# EasyEDA schematic Schametic.json
TITLE: Sheet_1; REV: 1.0; Date: 2026-03-11; Sheet: 1/1; Drawn By: rudravenommishraa; Company: Your Company
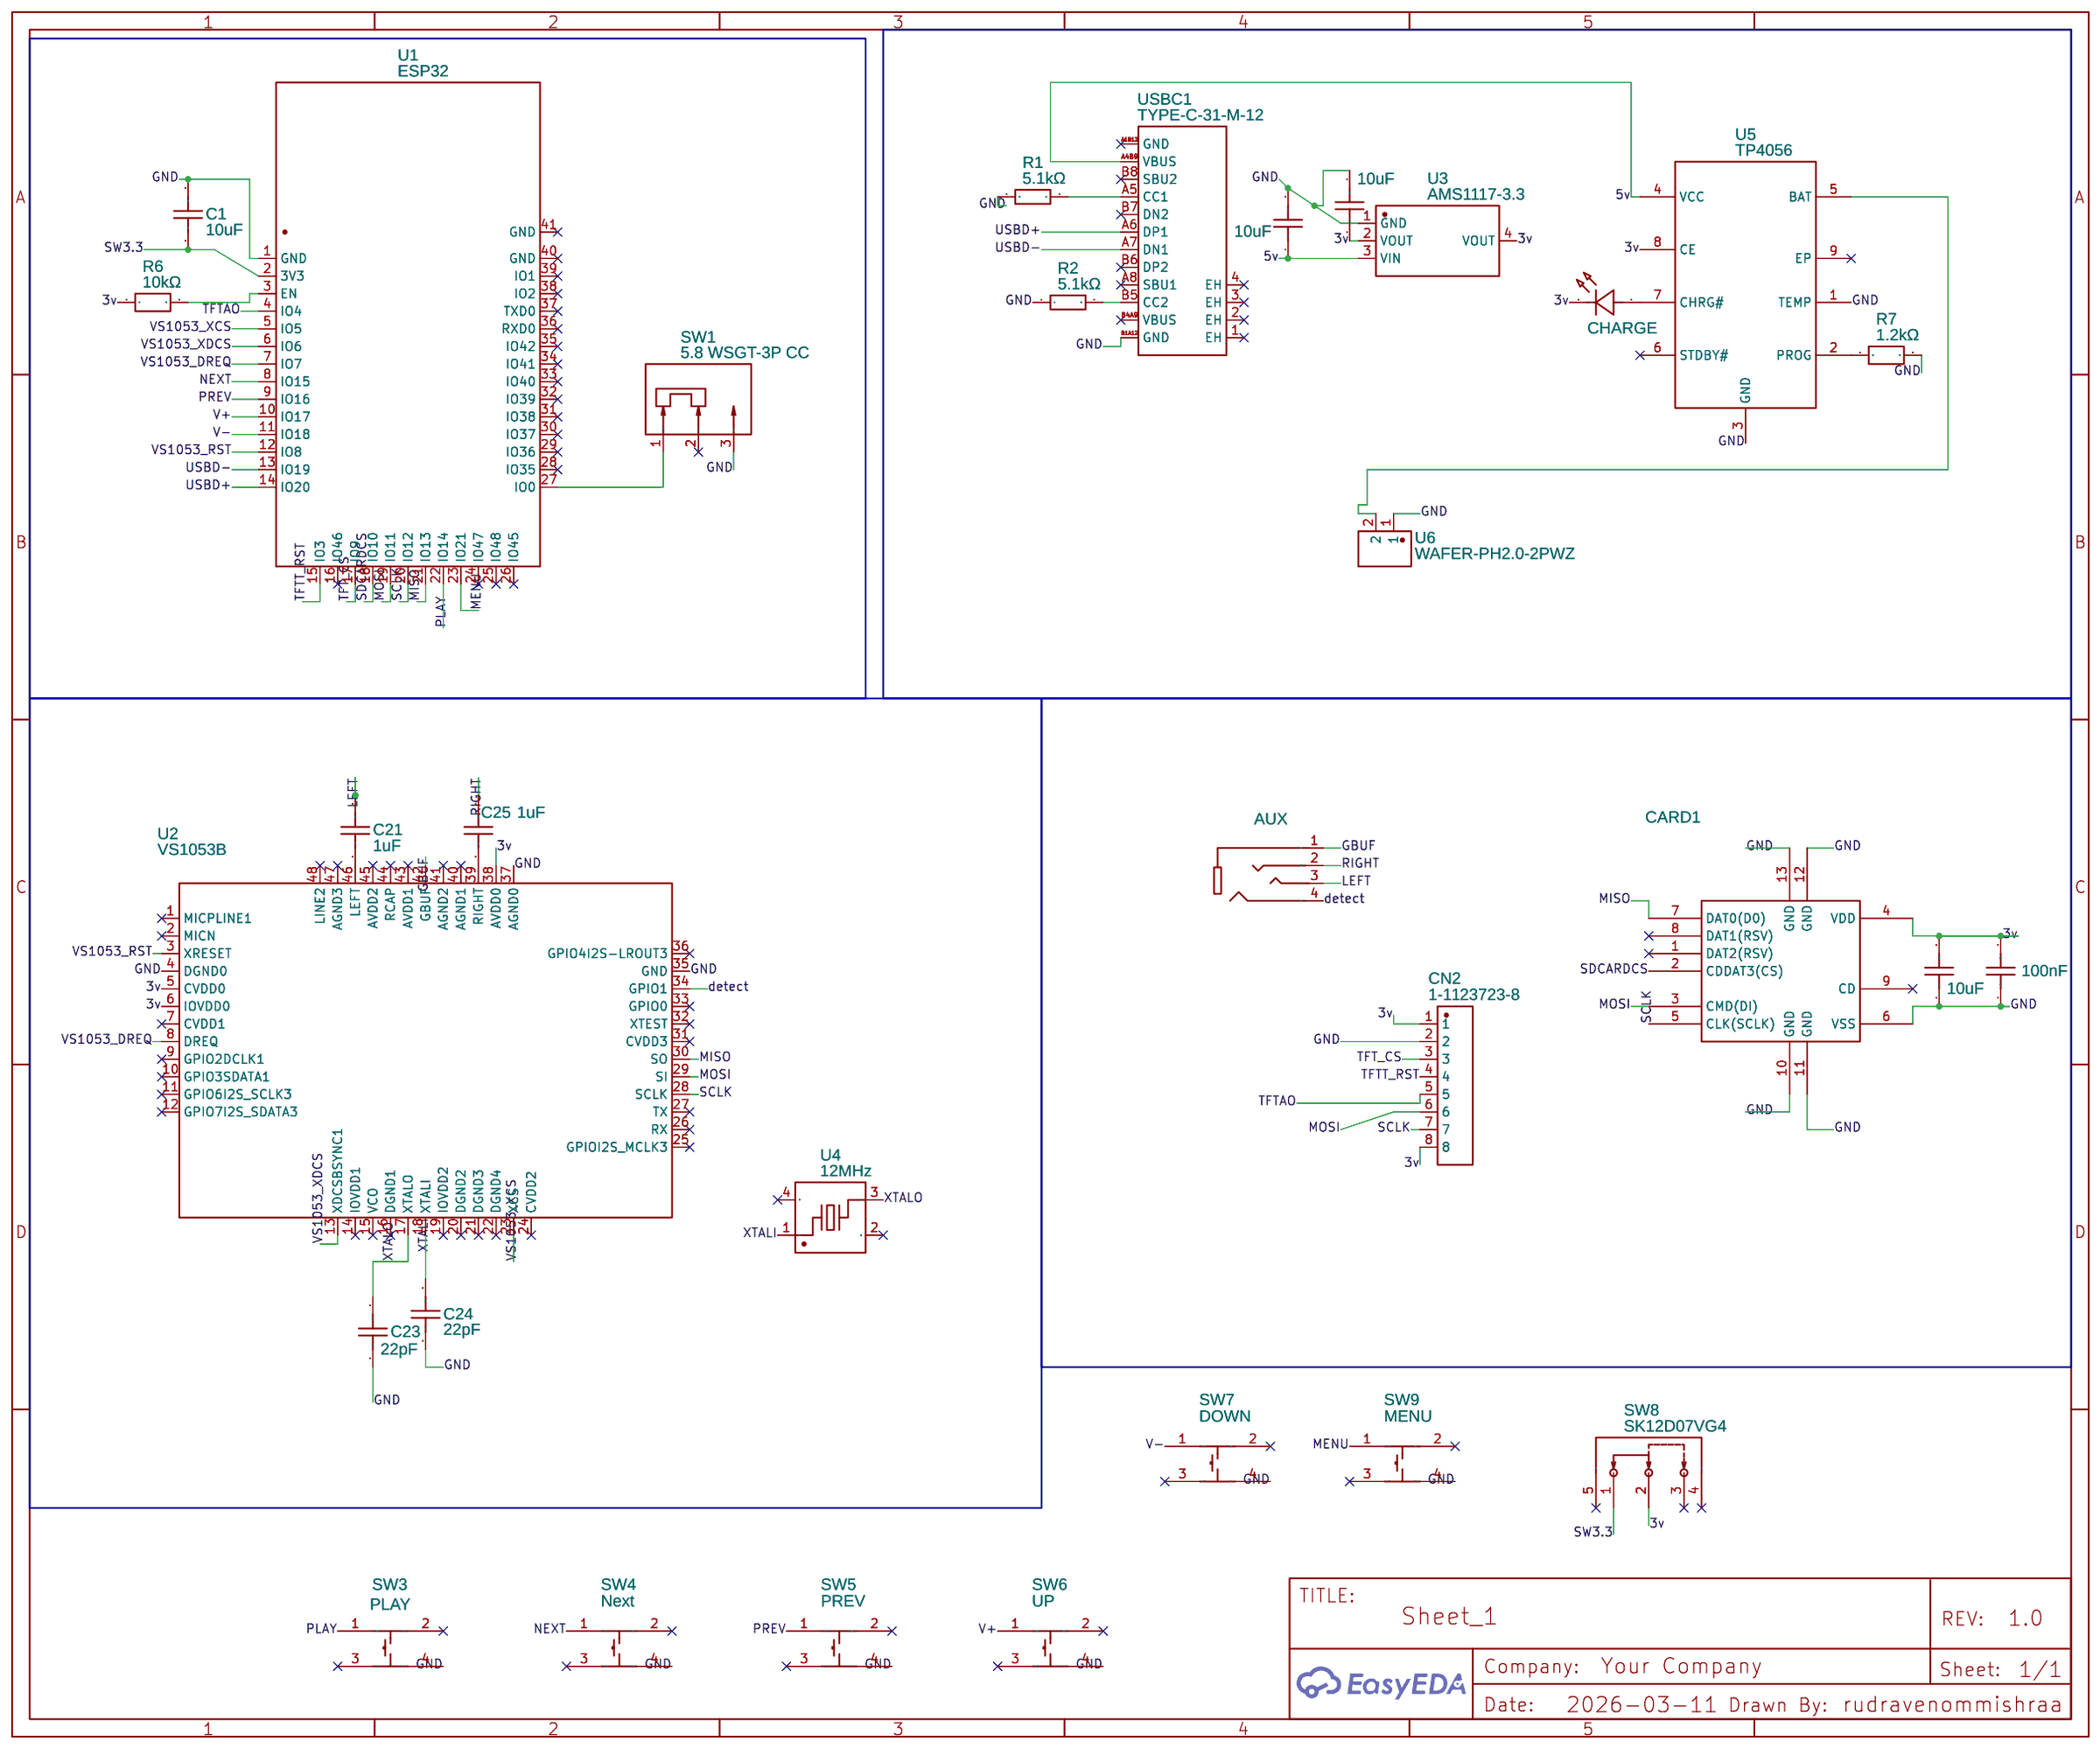
[diagram p0: schematic sheet]

## Parts
C1  10uF  [C0603]
C2  10uF  [C0603]
C7  100nF  [C0603]
C9  10uF  [C0603]
C10  10uF  [C0603]
C21  1uF  [C0603]
C23  22pF  [C0402]
C24  22pF  [C0402]
C25  1uF  [C0603]
CARD1  TF-01A  [TF-SMD_TF-01A]
CHARGE  15-21SURC/S530-A3/3T  [LED1206-R-RD_RED]
CN1  AUX  [AUDIO-SMD_HC-PJ-320A]
CN2  1-1123723-8  [CONN-TH_1-1123723-8]
R1  5.1kΩ  [R0603]
R2  5.1kΩ  [R0603]
R6  10kΩ  [R0603]
R7  1.2kΩ  [R0603]
SW1  5.8 WSGT-3P CC  [SW-TH_3P-L5.8_WSGT-3P-CC]
SW3  PLAY  [KEY-SMD_4P-L6.0-W6.0-P4.50-LS9.0]
SW4  Next  [KEY-SMD_4P-L6.0-W6.0-P4.50-LS9.0]
SW5  PREV  [KEY-SMD_4P-L6.0-W6.0-P4.50-LS9.0]
SW6  UP  [KEY-SMD_4P-L6.0-W6.0-P4.50-LS9.0]
SW7  DOWN  [KEY-SMD_4P-L6.0-W6.0-P4.50-LS9.0]
SW8  SK12D07VG4  [SW-TH_SK12D07VG4]
SW9  MENU  [KEY-SMD_4P-L6.0-W6.0-P4.50-LS9.0]
U1  ESP32  [WIRELM-SMD_ESP32-S3-WROOM-1]
U2  VS1053B  [LQFP-48_L7.0-W7.0-P0.50-LS9.0-BL]
U3  AMS1117-3.3  [SOT-223-3_L6.5-W3.4-P2.30-LS7.0-BR]
U4  12MHz  [CRYSTAL-SMD_4P-L3.2-W2.5-BL]
U5  TP4056  [ESOP-8_L4.9-W3.9-P1.27-LS6.0-BL-EP]
U6  WAFER-PH2.0-2PWZ  [CONN-TH_2P-P2.00_GP01-2001WR-2P]
USBC1  TYPE-C-31-M-12  [USB-C_SMD-TYPE-C-31-M-12_1]

## Library data of the parts
C1 C2 C9 C10 = CL10A106KP8NNNC: Supplier: LCSC; Manufacturer: SAMSUNG(三星); Supplier Part: C19702; JLCPCB Part Class: Basic Part
C7 = CC0603KRX7R9BB104: Supplier: LCSC; Manufacturer: YAGEO(国巨); Supplier Part: C14663; JLCPCB Part Class: Basic Part
C21 C25 = CL10A105KB8NNNC: Supplier: LCSC; Manufacturer: SAMSUNG(三星); Supplier Part: C15849; JLCPCB Part Class: Basic Part
C23 C24 = 04025A220KAT2A: Contributor: LCSC; Supplier: LCSC; Supplier Part: C597024; Manufacturer: Kyocera AVX; JLCPCB Part Class: Extended Part
CARD1 = TF-01A: Supplier: LCSC; Manufacturer: 韩国韩荣; Supplier Part: C91145; JLCPCB Part Class: Extended Part
CHARGE = 15-21SURC/S530-A3/3T: Supplier: LCSC; Supplier Part: C2984265; Manufacturer: EVERLIGHT(亿光); JLCPCB Part Class: Extended Part; Contributor: lcsc
CN1 = HC-PJ-320A: Supplier: LCSC; Supplier Part: C7501806; Manufacturer: HC(虹成电子); Contributor: lcsc; JLCPCB Part Class: Extended Part
CN2 = 1-1123723-8: Contributor: LCSC; Supplier: LCSC; Supplier Part: C498700; Manufacturer: TE Connectivity(泰科电子); JLCPCB Part Class: Extended Part
R1 R2 = 0603WAF5101T5E: Supplier: LCSC; Manufacturer: UNI-ROYAL(厚声); Supplier Part: C23186; JLCPCB Part Class: Basic Part
R6 = SCR0603J10K: Supplier: LCSC; Supplier Part: C3017715; Manufacturer: VO(翔胜); Contributor: lcsc; JLCPCB Part Class: Extended Part
R7 = 0603WAD1201T5E: Contributor: LCSC; Supplier: LCSC; Supplier Part: C423085; Manufacturer: UNI-ROYAL(厚声); JLCPCB Part Class: Extended Part
SW1 = 5.8 WSGT-3P CC: Supplier: LCSC; Supplier Part: C22386787; Manufacturer: SHOU HAN(首韩); Contributor: lcsc; JLCPCB Part Class: Extended Part
SW3-SW7 SW9 = TS-1002S-07026C: Contributor: LCSC; Supplier: LCSC; Supplier Part: C455114; Manufacturer: XUNPU(讯普); JLCPCB Part Class: Extended Part
SW8 = SK12D07VG4: Contributor: LCSC; Supplier: LCSC; Supplier Part: C393937; Manufacturer: SHOU HAN(首韩); JLCPCB Part Class: Extended Part
U1 = ESP32-S3-WROOM-1(N16R8): Contributor: lcsc; Supplier: LCSC; Supplier Part: C2913202; Manufacturer: ESPRESSIF(乐鑫); Manufacturer Part: ESP32-S3-WROOM-1-N16R8; JLCPCB Part Class: Extended Part
U2 = VS1053B: sourceId: 1T5FDZYC8; Supplier: LCSC; Manufacturer: VLSI; Manufacturer Part: VS1053B-L; Supplier Part: C9922; JLCPCB Part Class: Extended Part
U3 = AMS1117-3.3: sourceId: dwIGgezVh; Supplier: LCSC; Manufacturer: AMS; Supplier Part: C6186; JLCPCB Part Class: Basic Part
U4 = 01.X.MH.120HHRI0012000000: Supplier: LCSC; Supplier Part: C7462556; Manufacturer: CREC(晶宝); JLCPCB Part Class: Extended Part; Contributor: lcsc
U5 = TP4056: Contributor: Guest; Supplier: LCSC; Manufacturer: TOPPOWER(南京拓微); Manufacturer Part: TP4056-42-ESOP8; Supplier Part: C16581; JLCPCB Part Class: Extended Part
U6 = WAFER-PH2.0-2PWZ: Supplier: LCSC; Supplier Part: C5359610; Manufacturer: XUNPU(讯普); JLCPCB Part Class: Extended Part; Contributor: lcsc
USBC1 = TYPE-C-31-M-12: Contributor: LCSC; Supplier: LCSC; Supplier Part: C165948; Manufacturer: 韩国韩荣; JLCPCB Part Class: Extended Part

## Nets
3v: C2.2 C7.2 C10.1 CARD1.4(VDD) CHARGE.2(K) CN2.1 CN2.8 R6.1 SW8.2 U2.5(CVDD0) U2.6(IOVDD0) U2.38(AVDD0) U3.2(VOUT) U3.4(VOUT) U5.8(CE)
5v: C9.1 U3.3(VIN) U5.4(VCC) USBC1.A4B9(VBUS)
GND: C1.2 C2.1 C7.1 C9.2 C10.2 C23.1 C24.1 CARD1.6(VSS) CARD1.10(GND) CARD1.11(GND) CARD1.12(GND) CARD1.13(GND) CN2.2 R1.1 R2.1 R7.2 SW1.3 SW3.4 SW4.4 SW5.4 SW6.4 SW7.4 SW9.4 U1.1(GND) U2.4(DGND0) U2.35(GND) U2.37(AGND0) U3.1(GND) U5.1(TEMP) U5.3(GND) U6.1 USBC1.B1A12(GND)
detect: CN1.4 U2.34(GPIO1)
GBUF: CN1.1 U2.42(GBUF)
LEFT: C21.2 CN1.3
MENU: SW9.1 U1.23(IO21)
MISO: CARD1.7(DAT0(D0)) U1.21(IO13) U2.30(SO)
MOSI: CARD1.3(CMD(DI)) CN2.6 U1.19(IO11) U2.29(SI)
NEXT: SW4.1 U1.8(IO15)
PLAY: SW3.1 U1.22(IO14)
PREV: SW5.1 U1.9(IO16)
RIGHT: C25.1 CN1.2
SCLK: CARD1.5(CLK(SCLK)) CN2.7 U1.20(IO12) U2.28(SCLK)
SDCARDCS: CARD1.2(CDDAT3(CS)) U1.18(IO10)
SW3.3: C1.1 SW8.1 U1.2(3V3)
TFT_CS: CN2.3 U1.17(IO9)
TFTAO: CN2.5 U1.4(IO4)
TFTT_RST: CN2.4 U1.15(IO3)
USBD+: U1.14(IO20) USBC1.A6(DP1)
USBD-: U1.13(IO19) USBC1.A7(DN1)
V+: SW6.1 U1.10(IO17)
V-: SW7.1 U1.11(IO18)
VS1053_DREQ: U1.7(IO7) U2.8(DREQ)
VS1053_RST: U1.12(IO8) U2.3(XRESET)
VS1053_XCS: U1.5(IO5) U2.23(XCS)
VS1053_XDCS: U1.6(IO6) U2.13(XDCSBSYNC1)
XTALI: C24.2 U2.18(XTALI) U4.1
XTALO: C23.2 U2.17(XTALO) U4.3
Net-(C21-1): C21.1 U2.46(LEFT)
Net-(C25-2): C25.2 U2.39(RIGHT)
Net-(CHARGE-1): CHARGE.1(A) U5.7(CHRG#)
Net-(R1-2): R1.2 USBC1.A5(CC1)
Net-(R2-2): R2.2 USBC1.B5(CC2)
Net-(R6-2): R6.2 U1.3(EN)
Net-(R7-1): R7.1 U5.2(PROG)
Net-(SW1-1): SW1.1 U1.27(IO0)
Net-(U5-5): U5.5(BAT) U6.2

Not connected (* = marked no-connect by the designer): CARD1 1(DAT2(RSV))* 8(DAT1(RSV))* 9(CD)*; SW1 2*; SW3 2* 3*; SW4 2* 3*; SW5 2* 3*; SW6 2* 3*; SW7 2* 3*; SW8 3* 4* 5*; SW9 2* 3*; U1 16(IO46)* 24(IO47)* 25(IO48)* 26(IO45)* 28(IO35)* 29(IO36)* 30(IO37)* 31(IO38)* 32(IO39)* 33(IO40)* 34(IO41)* 35(IO42)* 36(RXD0)* 37(TXD0)* 38(IO2)* 39(IO1)* 40(GND)* 41(GND)*; U2 1(MICPLINE1)* 2(MICN)* 7(CVDD1)* 9(GPIO2DCLK1)* 10(GPIO3SDATA1)* 11(GPIO6I2S_SCLK3)* 12(GPIO7I2S_SDATA3)* 14(IOVDD1)* 15(VCO)* 16(DGND1)* 19(IOVDD2)* 20(DGND2)* 21(DGND3)* 22(DGND4)* 24(CVDD2)* 25(GPIOI2S_MCLK3)* 26(RX)* 27(TX)* 31(CVDD3)* 32(XTEST)* 33(GPIO0)* 36(GPIO4I2S-LROUT3)* 40(AGND1)* 41(AGND2)* 43(AVDD1)* 44(RCAP)* 45(AVDD2)* 47(AGND3)* 48(LINE2)*; U4 2(GND)* 4(GND)*; U5 6(STDBY#)* 9(EP)*; USBC1 1(EH)* 2(EH)* 3(EH)* 4(EH)* A1B12(GND)* A8(SBU1)* B4A9(VBUS)* B6(DP2)* B7(DN2)* B8(SBU2)*
